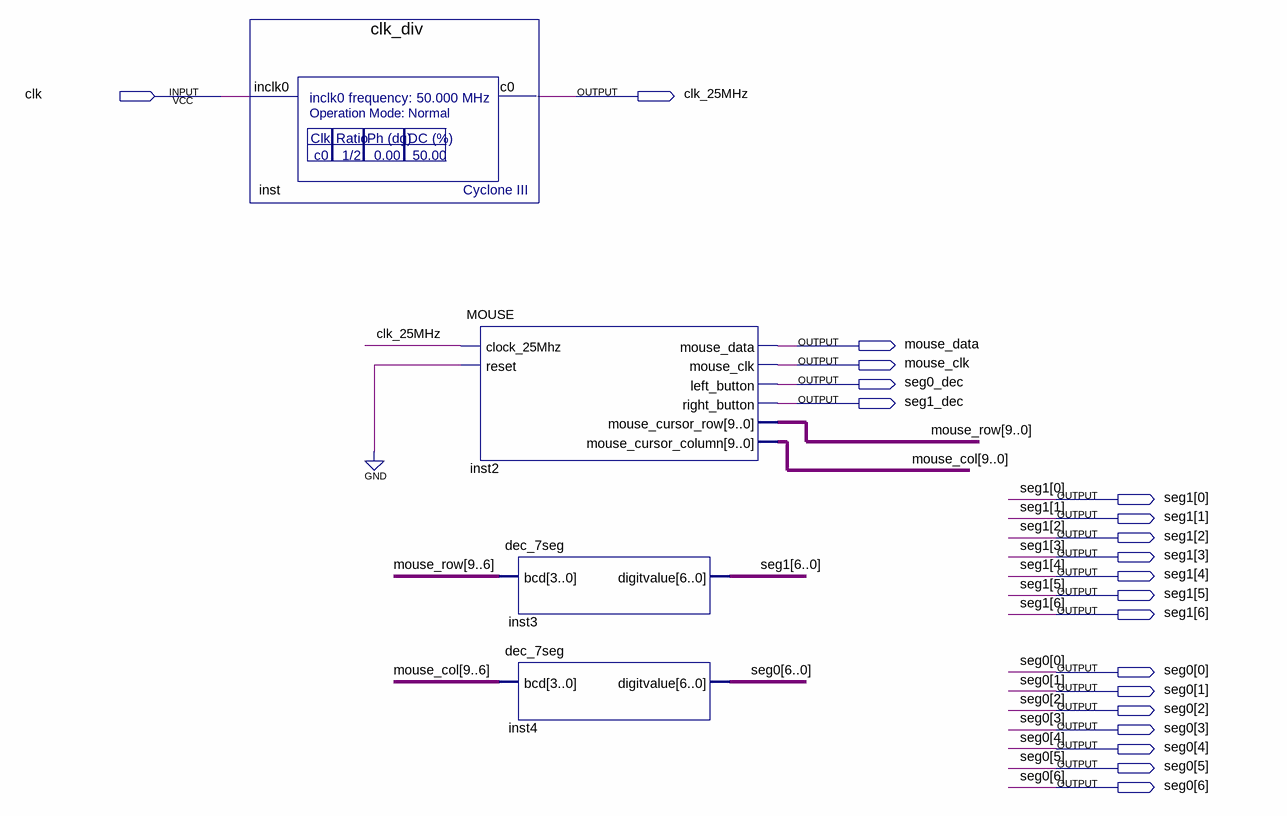
[diagram p0: schematic sheet]
// Quartus schematic UniPong_mouse.bdf as structural Verilog: 4 symbols, 20 pins
module UniPong_mouse (
  input  clk,
  output clk_25MHz,
  output mouse_data,
  output mouse_clk,
  output seg0_dec,
  output seg1_dec,
  output [6:0] seg1,
  output [6:0] seg0
);

  wire [9:0] mouse_col, mouse_row;

  clk_div inst (.inclk0(clk), .c0(clk_25MHz));
  MOUSE inst2 (
    .clock_25Mhz(clk_25MHz), .reset(1'b0), .left_button(seg0_dec), .right_button(seg1_dec),
    .mouse_cursor_row(mouse_row), .mouse_cursor_column(mouse_col), .mouse_data(mouse_data),
    .mouse_clk(mouse_clk));
  dec_7seg inst3 (.bcd(mouse_row[9:6]), .digitvalue(seg1));
  dec_7seg inst4 (.bcd(mouse_col[9:6]), .digitvalue(seg0));
endmodule
